# Altium schematic sheet ARM_CTR_STM_DRV.SchDoc
size A4
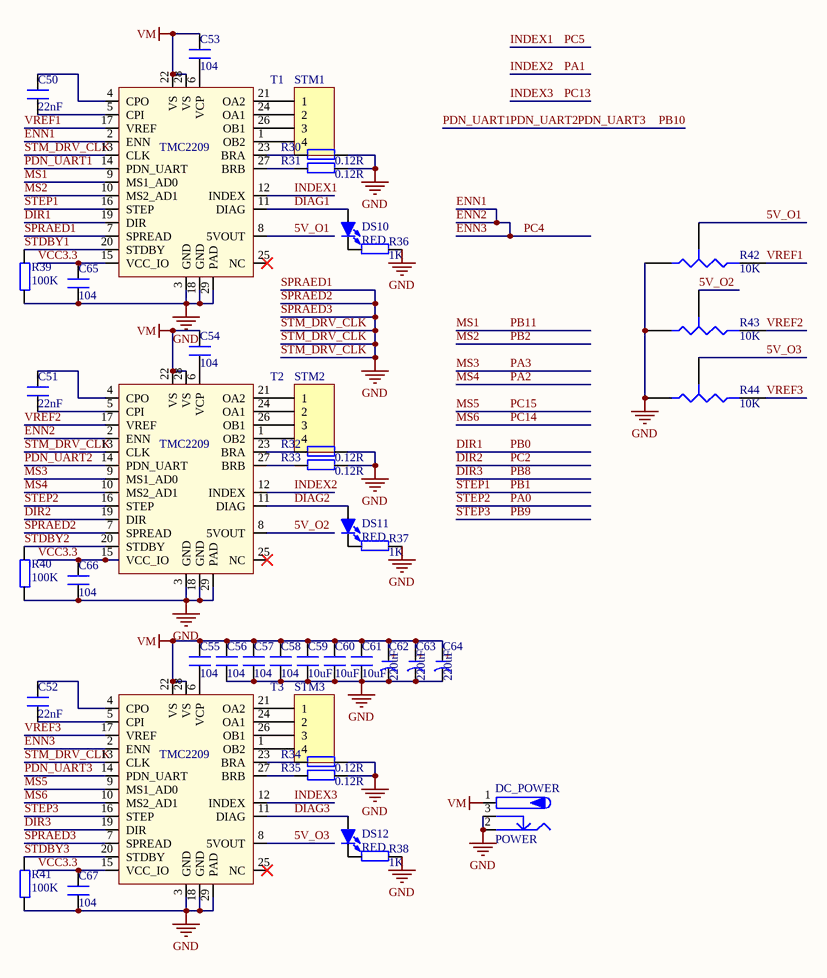
[diagram p0: ARM_CTR_STM_DRV.SchDoc]

## Parts
C50  22nF  [C 0603_L]
C51  22nF  [C 0603_L]
C52  22nF  [C 0603_L]
C53  104  [C 0603_L]
C54  104  [C 0603_L]
C55  104  [C 0603_L]
C56  104  [C 0603_L]
C57  104  [C 0603_L]
C58  104  [C 0603_L]
C59  10uF  [C 0603_L]
C60  10uF  [C 0603_L]
C61  10uF  [C 0603_L]
C62  220uF  [CM D(6.3*5.4)]
C63  220uF  [CM D(6.3*5.4)]
C64  220uF  [CM D(6.3*5.4)]
C65  104  [C 0603_L]
C66  104  [C 0603_L]
C67  104  [C 0603_L]
DC_POWER  POWER  [DC10B]
DS10  RED  [LED 0805R]
DS11  RED  [LED 0805R]
DS12  RED  [LED 0805R]
R30  0.12R  [R 0805_L]
R31  0.12R  [R 0805_L]
R32  0.12R  [R 0805_L]
R33  0.12R  [R 0805_L]
R34  0.12R  [R 0805_L]
R35  0.12R  [R 0805_L]
R36  1K  [R 0603_L]
R37  1K  [R 0603_L]
R38  1K  [R 0603_L]
R39  100K  [R 0603_L]
R40  100K  [R 0603_L]
R41  100K  [R 0603_L]
R42  value 10K  [3362P]  (hidden comment: Res Tap)
R43  value 10K  [3362P]  (hidden comment: Res Tap)
R44  value 10K  [3362P]  (hidden comment: Res Tap)
STM1  Header 4  [XH2.54-WI-4P]  (value not drawn)
STM2  Header 4  [XH2.54-WI-4P]  (value not drawn)
STM3  Header 4  [XH2.54-WI-4P]  (value not drawn)
T1  TMC2209  [QFN28 5x5_L]
T2  TMC2209  [QFN28 5x5_L]
T3  TMC2209  [QFN28 5x5_L]

## Nets
SPRAED1: C56.1 C57.1 C58.1 C59.1 C60.1 C61.1 C62.2(K) C63.2(K) C64.2(K) C65.1 C66.1 C67.1 DC_POWER.2 DC_POWER.3 R30.1 R31.1 R32.1 R33.1 R34.1 R35.1 R36.1 R37.1 R38.1 R39.1 R40.1 R41.1 R42.1(A) R43.1(A) R44.1(A) T1.3(GND) T1.7(SPREAD) T1.13(CLK) T1.18(GND) T1.29(PAD) T2.3(GND) T2.7(SPREAD) T2.13(CLK) T2.18(GND) T2.29(PAD) T3.3(GND) T3.7(SPREAD) T3.13(CLK) T3.18(GND) T3.29(PAD)  [also labelled GND, SPRAED2, SPRAED3, STM_DRV_CLK]
VM: C53.2 C54.2 C55.2 C56.2 C57.2 C58.2 C59.2 C60.2 C61.2 C62.1(A) C63.1(A) C64.1(A) DC_POWER.1 T1.22(VS) T1.28(VS) T2.22(VS) T2.28(VS) T3.22(VS) T3.28(VS)
5V_O1: R42.3(TAP) T1.8(5VOUT)
5V_O2: R43.3(TAP) T2.8(5VOUT)
5V_O3: R44.3(TAP) T3.8(5VOUT)
DIAG1: DS10.1(A) T1.11(DIAG)
DIAG2: DS11.1(A) T2.11(DIAG)
DIAG3: DS12.1(A) T3.11(DIAG)
DIR1: T1.19(DIR)  [also labelled PB0]
DIR2: T2.19(DIR)  [also labelled PC2]
DIR3: T3.19(DIR)  [also labelled PB8]
ENN1: T1.2(ENN) T2.2(ENN) T3.2(ENN)  [also labelled ENN2, ENN3, PC4]
INDEX1: T1.12(INDEX)  [also labelled PC5]
INDEX2: T2.12(INDEX)  [also labelled PA1]
INDEX3: T3.12(INDEX)  [also labelled PC13]
MS1: T1.9(MS1_AD0)  [also labelled PB11]
MS2: T1.10(MS2_AD1)  [also labelled PB2]
MS3: T2.9(MS1_AD0)  [also labelled PA3]
MS4: T2.10(MS2_AD1)  [also labelled PA2]
MS5: T3.9(MS1_AD0)  [also labelled PC15]
MS6: T3.10(MS2_AD1)  [also labelled PC14]
PA0: T2.16(STEP)  [also labelled STEP2]
PB1: T1.16(STEP)  [also labelled STEP1]
PB9: T3.16(STEP)  [also labelled STEP3]
PB10: T1.14(PDN_UART) T2.14(PDN_UART) T3.14(PDN_UART)  [also labelled PDN_UART1, PDN_UART2, PDN_UART3]
STDBY1: R39.2 T1.20(STDBY)
STDBY2: R40.2 T2.20(STDBY)
STDBY3: R41.2 T3.20(STDBY)
VCC3.3: C65.2 C66.2 C67.2 T1.15(VCC_IO) T2.15(VCC_IO) T3.15(VCC_IO)
VREF1: R42.2(B) T1.17(VREF)
VREF2: R43.2(B) T2.17(VREF)
VREF3: R44.2(B) T3.17(VREF)
NetC50_1: C50.1 T1.5(CPI)
NetC50_2: C50.2 T1.4(CPO)
NetC51_1: C51.1 T2.5(CPI)
NetC51_2: C51.2 T2.4(CPO)
NetC52_1: C52.1 T3.5(CPI)
NetC52_2: C52.2 T3.4(CPO)
NetC53_1: C53.1 T1.6(VCP)
NetC54_1: C54.1 T2.6(VCP)
NetC55_1: C55.1 T3.6(VCP)
NetDS10_2: DS10.2(K) R36.2
NetDS11_2: DS11.2(K) R37.2
NetDS12_2: DS12.2(K) R38.2
NetR30_2: R30.2 T1.23(BRA)
NetR31_2: R31.2 T1.27(BRB)
NetR32_2: R32.2 T2.23(BRA)
NetR33_2: R33.2 T2.27(BRB)
NetR34_2: R34.2 T3.23(BRA)
NetR35_2: R35.2 T3.27(BRB)
NetSTM1_1: STM1.1 T1.21(OA2)
NetSTM1_2: STM1.2 T1.24(OA1)
NetSTM1_3: STM1.3 T1.26(OB1)
NetSTM1_4: STM1.4 T1.1(OB2)
NetSTM2_1: STM2.1 T2.21(OA2)
NetSTM2_2: STM2.2 T2.24(OA1)
NetSTM2_3: STM2.3 T2.26(OB1)
NetSTM2_4: STM2.4 T2.1(OB2)
NetSTM3_1: STM3.1 T3.21(OA2)
NetSTM3_2: STM3.2 T3.24(OA1)
NetSTM3_3: STM3.3 T3.26(OB1)
NetSTM3_4: STM3.4 T3.1(OB2)

Not connected (* = marked no-connect by the designer): T1 25(NC)*; T2 25(NC)*; T3 25(NC)*

## Notes on the sheet
- (in symbol C-CM) +

## Library data of the parts
C50-C61 C65-C67 = C
C62-C64 = C-CM: 贴片电解电容; 版权归属: 源创客; BOM名称: 贴片电解电容; 学习资源: www.ooocke.com
DC_POWER = P-DC: 低压电源接口; BOM名称: DC电源接口; 版权归属: 源创客; 学习资源: www.ooocke.com
DS10-DS12 = LED-SMD: 贴片LED; 版权归属: 源创客; BOM名称: 贴片LED; 学习资源: www.ooocke.com
R30-R41 = R
R42-R44 = Res Tap: Tapped Resistor; Sim Note: Enter the Resistance value and the set point into parameter fields.; Set Position: 0.5; Published: 24-Mar-1999; LatestRevisionDate: 17-Jul-2002; LatestRevisionNote: Re-released for DXP Platform.; PackageReference: VR3; Publisher: Altium Limited; PackageDescription: Variable Resistor, Thru-Hole; 3 Leads
STM1-STM3 = Header 4: Header, 4-Pin; LatestRevisionDate: 17-Jul-2002; LatestRevisionNote: Re-released for DXP Platform.; Publisher: Altium Limited
T1-T3 = TMC2209: 步进电机驱动芯片